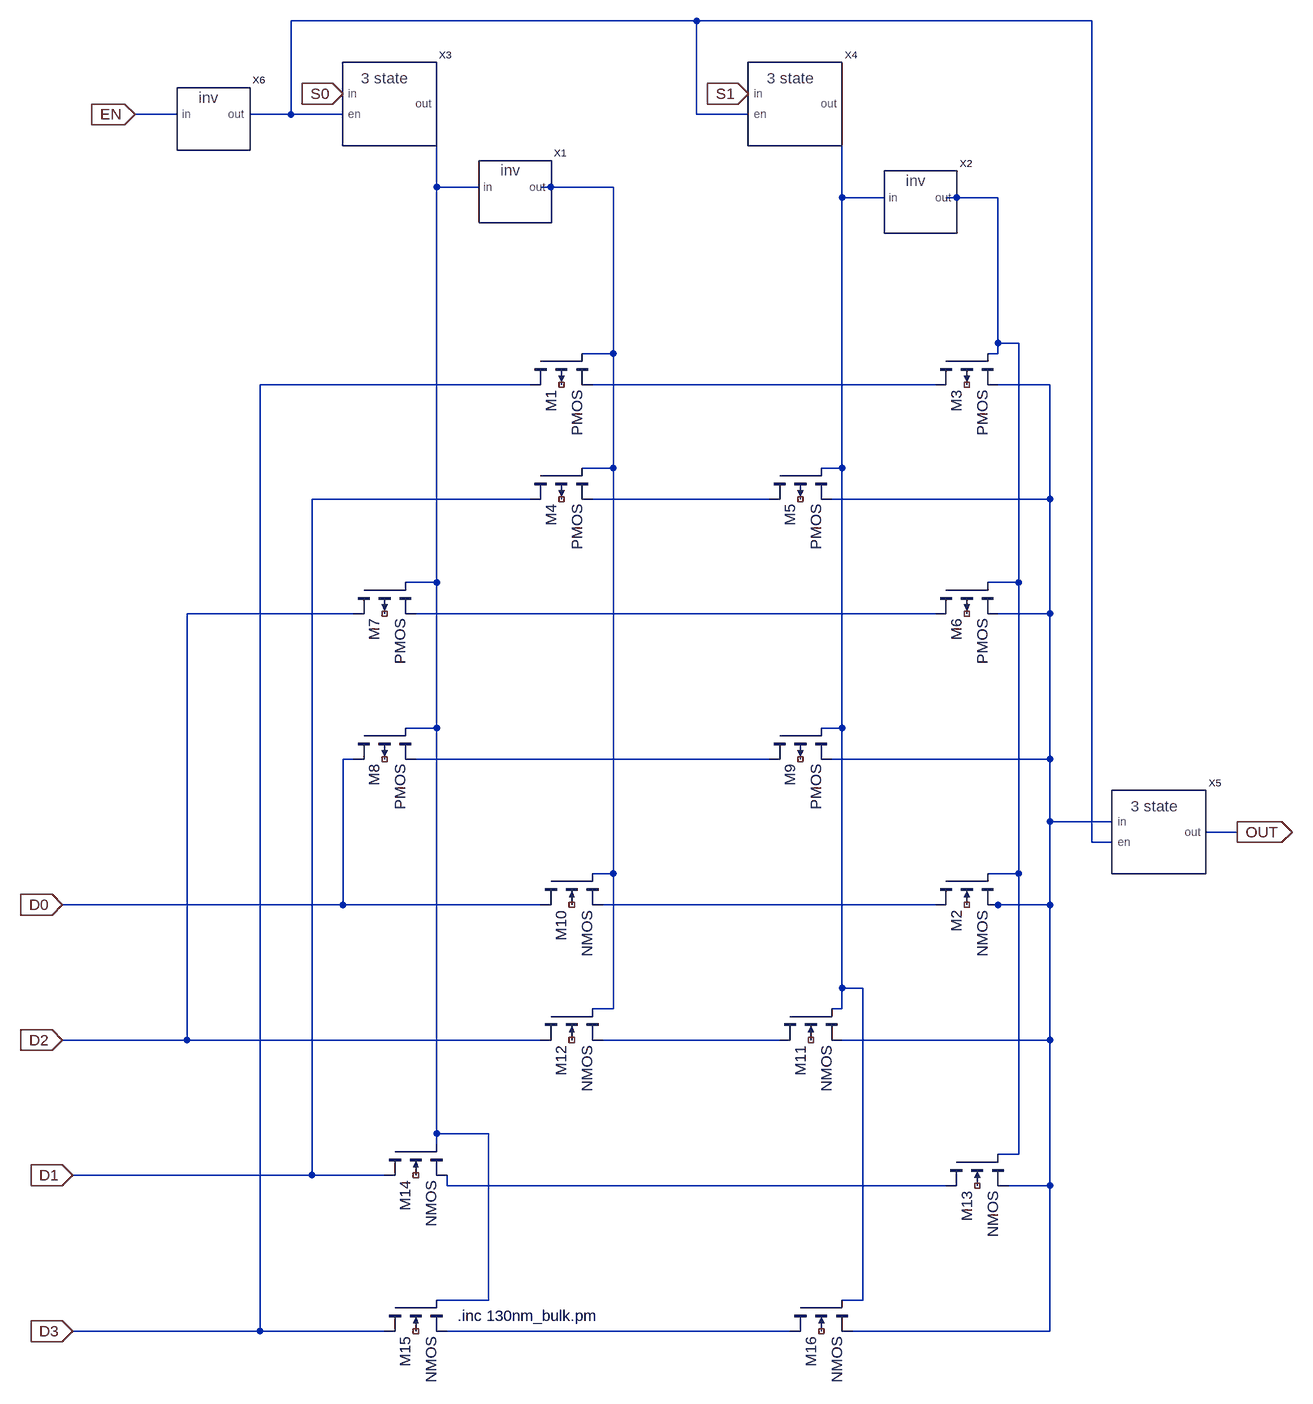
[diagram p0: schematic mux.asc]
mux.asc, the LTspice schematic file:
Version 4
SHEET 1 1484 724
WIRE 544 -1376 -80 -1376
WIRE 1152 -1376 544 -1376
WIRE -256 -1232 -320 -1232
WIRE -80 -1232 -80 -1376
WIRE -80 -1232 -144 -1232
WIRE 0 -1232 -80 -1232
WIRE 544 -1232 544 -1376
WIRE 624 -1232 544 -1232
WIRE 144 -1120 144 -1248
WIRE 208 -1120 144 -1120
WIRE 320 -1120 304 -1120
WIRE 416 -1120 320 -1120
WIRE 768 -1104 768 -1248
WIRE 832 -1104 768 -1104
WIRE 944 -1104 928 -1104
WIRE 1008 -1104 944 -1104
WIRE 1008 -880 1008 -1104
WIRE 1040 -880 1008 -880
WIRE 416 -864 416 -1120
WIRE 416 -864 368 -864
WIRE 1008 -864 1008 -880
WIRE 1008 -864 992 -864
WIRE 288 -816 -128 -816
WIRE 912 -816 384 -816
WIRE 1088 -816 1008 -816
WIRE 416 -688 416 -864
WIRE 416 -688 368 -688
WIRE 768 -688 768 -1104
WIRE 768 -688 736 -688
WIRE 288 -640 -48 -640
WIRE 656 -640 384 -640
WIRE 1088 -640 1088 -816
WIRE 1088 -640 752 -640
WIRE 144 -512 144 -1120
WIRE 144 -512 96 -512
WIRE 1040 -512 1040 -880
WIRE 1040 -512 992 -512
WIRE 16 -464 -240 -464
WIRE 912 -464 112 -464
WIRE 1088 -464 1088 -640
WIRE 1088 -464 1008 -464
WIRE 144 -288 144 -512
WIRE 144 -288 96 -288
WIRE 768 -288 768 -688
WIRE 768 -288 736 -288
WIRE 16 -240 0 -240
WIRE 656 -240 112 -240
WIRE 1088 -240 1088 -464
WIRE 1088 -240 752 -240
WIRE 1088 -144 1088 -240
WIRE 1184 -144 1088 -144
WIRE 1376 -128 1328 -128
WIRE 1152 -112 1152 -1376
WIRE 1184 -112 1152 -112
WIRE 416 -64 416 -688
WIRE 416 -64 384 -64
WIRE 1040 -64 1040 -512
WIRE 1040 -64 992 -64
WIRE 0 -16 0 -240
WIRE 0 -16 -432 -16
WIRE 304 -16 0 -16
WIRE 912 -16 400 -16
WIRE 1008 -16 992 -16
WIRE 1088 -16 1088 -144
WIRE 1088 -16 1008 -16
WIRE 768 112 768 -288
WIRE 800 112 768 112
WIRE 416 144 416 -64
WIRE 416 144 384 144
WIRE 768 144 768 112
WIRE 768 144 752 144
WIRE -240 192 -240 -464
WIRE -240 192 -432 192
WIRE 304 192 -240 192
WIRE 672 192 400 192
WIRE 1088 192 1088 -16
WIRE 1088 192 768 192
WIRE 144 336 144 -288
WIRE 224 336 144 336
WIRE 144 352 144 336
WIRE 1040 368 1040 -64
WIRE 1040 368 1008 368
WIRE -48 400 -48 -640
WIRE -48 400 -416 400
WIRE 64 400 -48 400
WIRE 160 416 160 400
WIRE 928 416 160 416
WIRE 1088 416 1088 192
WIRE 1088 416 1024 416
WIRE 224 592 224 336
WIRE 224 592 144 592
WIRE 800 592 800 112
WIRE 800 592 768 592
WIRE -128 640 -128 -816
WIRE -128 640 -416 640
WIRE 64 640 -128 640
WIRE 688 640 160 640
WIRE 1088 640 1088 416
WIRE 1088 640 784 640
FLAG 1376 -128 OUT
IOPIN 1376 -128 Out
FLAG -416 640 D3
IOPIN -416 640 In
FLAG -416 400 D1
IOPIN -416 400 In
FLAG -432 192 D2
IOPIN -432 192 In
FLAG -432 -16 D0
IOPIN -432 -16 In
FLAG 0 -1264 S0
IOPIN 0 -1264 In
FLAG 624 -1264 S1
IOPIN 624 -1264 In
FLAG -320 -1232 EN
IOPIN -320 -1232 In
SYMBOL pmos4 288 -864 M90
SYMATTR InstName M1
SYMATTR Value2 l=130e-9 w=2600e-9 ad=676000e-18 as=676000e-18 pd=3640e-9 ps=3640e-9
SYMBOL nmos4 912 -64 M90
SYMATTR InstName M2
SYMATTR Value2 l=130e-9 w=1300e-9 ad=676000e-18 as=676000e-18 pd=3640e-9 ps=3640e-9
SYMBOL pmos4 912 -864 M90
SYMATTR InstName M3
SYMATTR Value2 l=130e-9 w=2600e-9 ad=676000e-18 as=676000e-18 pd=3640e-9 ps=3640e-9
SYMBOL pmos4 288 -688 M90
SYMATTR InstName M4
SYMATTR Value2 l=130e-9 w=2600e-9 ad=676000e-18 as=676000e-18 pd=3640e-9 ps=3640e-9
SYMBOL pmos4 656 -688 M90
SYMATTR InstName M5
SYMATTR Value2 l=130e-9 w=2600e-9 ad=676000e-18 as=676000e-18 pd=3640e-9 ps=3640e-9
SYMBOL pmos4 912 -512 M90
SYMATTR InstName M6
SYMATTR Value2 l=130e-9 w=2600e-9 ad=676000e-18 as=676000e-18 pd=3640e-9 ps=3640e-9
SYMBOL pmos4 16 -512 M90
SYMATTR InstName M7
SYMATTR Value2 l=130e-9 w=2600e-9 ad=676000e-18 as=676000e-18 pd=3640e-9 ps=3640e-9
SYMBOL pmos4 16 -288 M90
SYMATTR InstName M8
SYMATTR Value2 l=130e-9 w=2600e-9 ad=676000e-18 as=676000e-18 pd=3640e-9 ps=3640e-9
SYMBOL pmos4 656 -288 M90
SYMATTR InstName M9
SYMATTR Value2 l=130e-9 w=2600e-9 ad=676000e-18 as=676000e-18 pd=3640e-9 ps=3640e-9
SYMBOL nmos4 304 -64 M90
SYMATTR InstName M10
SYMATTR Value2 l=130e-9 w=1300e-9 ad=676000e-18 as=676000e-18 pd=3640e-9 ps=3640e-9
SYMBOL nmos4 672 144 M90
SYMATTR InstName M11
SYMATTR Value2 l=130e-9 w=1300e-9 ad=676000e-18 as=676000e-18 pd=3640e-9 ps=3640e-9
SYMBOL nmos4 304 144 M90
SYMATTR InstName M12
SYMATTR Value2 l=130e-9 w=1300e-9 ad=676000e-18 as=676000e-18 pd=3640e-9 ps=3640e-9
SYMBOL nmos4 928 368 M90
SYMATTR InstName M13
SYMATTR Value2 l=130e-9 w=1300e-9 ad=676000e-18 as=676000e-18 pd=3640e-9 ps=3640e-9
SYMBOL nmos4 64 352 M90
SYMATTR InstName M14
SYMATTR Value2 l=130e-9 w=1300e-9 ad=676000e-18 as=676000e-18 pd=3640e-9 ps=3640e-9
SYMBOL nmos4 64 592 M90
SYMATTR InstName M15
SYMATTR Value2 l=130e-9 w=1300e-9 ad=676000e-18 as=676000e-18 pd=3640e-9 ps=3640e-9
SYMBOL nmos4 688 592 M90
SYMATTR InstName M16
SYMATTR Value2 l=130e-9 w=1300e-9 ad=676000e-18 as=676000e-18 pd=3640e-9 ps=3640e-9
SYMBOL invert 256 -1104 R0
SYMATTR InstName X1
SYMBOL invert 880 -1088 R0
SYMATTR InstName X2
SYMBOL three_state_new 80 -1280 R0
SYMATTR InstName X3
SYMBOL three_state_new 704 -1280 R0
SYMATTR InstName X4
SYMBOL three_state_new 1264 -160 R0
SYMATTR InstName X5
SYMBOL invert -208 -1216 R0
SYMATTR InstName X6
TEXT 176 616 Left 2 !.inc 130nm_bulk.pm

The netlist it stands for:
* mux.asc
M1 D3 N003 N006 NC_01 PMOS l=130e-9 w=2600e-9 ad=676000e-18 as=676000e-18 pd=3640e-9 ps=3640e-9
* M2: NMOS l=130e-9 w=1300e-9 ad=676000e-18 as=676000e-18 pd=3640e-9 ps=3640e-9 (symbol nmos4 not certain, pin order unknown); nets seen at it: N005, N007, N011
M3 N006 N005 N007 NC_03 PMOS l=130e-9 w=2600e-9 ad=676000e-18 as=676000e-18 pd=3640e-9 ps=3640e-9
M4 D1 N003 N008 NC_04 PMOS l=130e-9 w=2600e-9 ad=676000e-18 as=676000e-18 pd=3640e-9 ps=3640e-9
M5 N008 N004 N007 NC_05 PMOS l=130e-9 w=2600e-9 ad=676000e-18 as=676000e-18 pd=3640e-9 ps=3640e-9
M6 N009 N005 N007 NC_06 PMOS l=130e-9 w=2600e-9 ad=676000e-18 as=676000e-18 pd=3640e-9 ps=3640e-9
M7 D2 N002 N009 NC_07 PMOS l=130e-9 w=2600e-9 ad=676000e-18 as=676000e-18 pd=3640e-9 ps=3640e-9
M8 D0 N002 N010 NC_08 PMOS l=130e-9 w=2600e-9 ad=676000e-18 as=676000e-18 pd=3640e-9 ps=3640e-9
M9 N010 N004 N007 NC_09 PMOS l=130e-9 w=2600e-9 ad=676000e-18 as=676000e-18 pd=3640e-9 ps=3640e-9
M10 D0 N003 N011 NC_10 NMOS l=130e-9 w=1300e-9 ad=676000e-18 as=676000e-18 pd=3640e-9 ps=3640e-9
M11 N012 N004 N007 NC_11 NMOS l=130e-9 w=1300e-9 ad=676000e-18 as=676000e-18 pd=3640e-9 ps=3640e-9
M12 D2 N003 N012 NC_12 NMOS l=130e-9 w=1300e-9 ad=676000e-18 as=676000e-18 pd=3640e-9 ps=3640e-9
M13 N013 N005 N007 NC_13 NMOS l=130e-9 w=1300e-9 ad=676000e-18 as=676000e-18 pd=3640e-9 ps=3640e-9
M14 D1 N002 N013 NC_14 NMOS l=130e-9 w=1300e-9 ad=676000e-18 as=676000e-18 pd=3640e-9 ps=3640e-9
M15 D3 N002 N014 NC_15 NMOS l=130e-9 w=1300e-9 ad=676000e-18 as=676000e-18 pd=3640e-9 ps=3640e-9
M16 N014 N004 N007 NC_16 NMOS l=130e-9 w=1300e-9 ad=676000e-18 as=676000e-18 pd=3640e-9 ps=3640e-9
XX1 N002 N003 invert  ; pins in out
XX2 N004 N005 invert  ; pins in out
XX3 S0 N001 N002 three_state_new  ; pins in en out
XX4 S1 N001 N004 three_state_new  ; pins in en out
XX5 N007 N001 OUT three_state_new  ; pins in en out
XX6 EN N001 invert  ; pins in out
.model NMOS NMOS
.model PMOS PMOS
.lib standard.mos
.inc 130nm_bulk.pm
.backanno
.end